# EAGLE design controller (EAGLE 6.3)
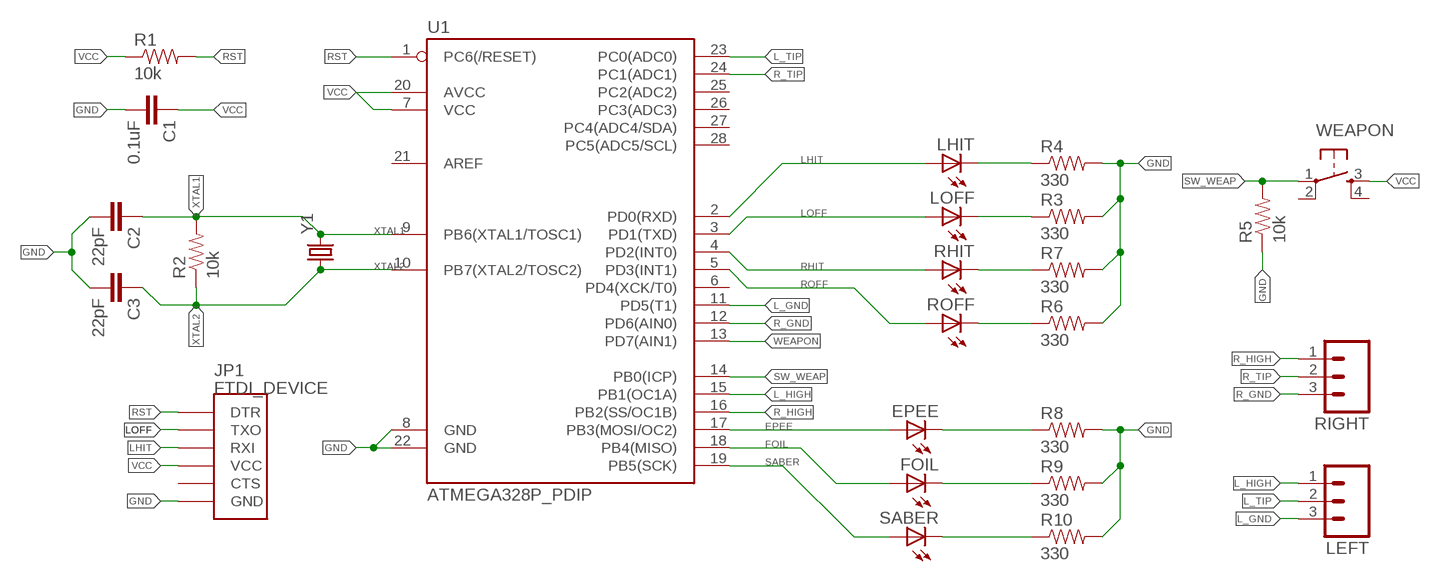
[diagram p0: schematic, sheet 1]

## Parts
C1  0.1uF  CAPKIT  [CAP-PTH-SMALL-KIT]
C2  22pF  CAPKIT  [CAP-PTH-SMALL-KIT]
C3  22pF  CAPKIT  [CAP-PTH-SMALL-KIT]
EPEE  LED5MM  [LED5MM]
FOIL  LED5MM  [LED5MM]
JP1  FTDI_DEVICE  [FTDI_DEVICE_SIDE]
LEFT  M03LOCK_LONGPADS  [1X03_LOCK_LONGPADS]
LHIT  LED5MM  [LED5MM]
LOFF  LED5MM  [LED5MM]
R1  10k  RESISTORPTH-1/4W  [AXIAL-0.4]
R2  10k  RESISTORPTH-1/4W  [AXIAL-0.4]
R3  330  RESISTOR0603-RES  [0603-RES]
R4  330  RESISTOR0603-RES  [0603-RES]
R5  10k  RESISTORPTH-1/4W  [AXIAL-0.4]
R6  330  RESISTOR0603-RES  [0603-RES]
R7  330  RESISTOR0603-RES  [0603-RES]
R8  330  RESISTOR0603-RES  [0603-RES]
R9  330  RESISTOR0603-RES  [0603-RES]
R10  330  RESISTOR0603-RES  [0603-RES]
RHIT  LED5MM  [LED5MM]
RIGHT  M03LOCK_LONGPADS  [1X03_LOCK_LONGPADS]
ROFF  LED5MM  [LED5MM]
SABER  LED5MM  [LED5MM]
U1  ATMEGA328P_PDIP  [DIL28-3]
WEAPON  TAC_SWITCHPTH  [TACTILE-PTH]
Y1  CRYSTALHC49US  [HC49US]

## Nets
EPEE: EPEE.A U1.17(PB3(MOSI/OC2))
FOIL: FOIL.A U1.18(PB4(MISO))
GND: C1.2 C2.2 C3.2 JP1.P$6(GND) R3.2 R4.2 R5.P$1 R6.2 R7.2 R8.2 R9.2 R10.2 U1.8(GND) U1.22(GND)
L_GND: LEFT.3 U1.11(PD5(T1))
L_HIGH: LEFT.1 U1.15(PB1(OC1A))
L_TIP: LEFT.2 U1.23(PC0(ADC0))
LHIT: JP1.P$3(RXI) LHIT.A U1.2(PD0(RXD))
LOFF: JP1.P$2(TXO) LOFF.A U1.3(PD1(TXD))
N$1: LHIT.K(C) R4.1
N$2: LOFF.K(C) R3.1
N$3: R7.1 RHIT.K(C)
N$4: R6.1 ROFF.K(C)
N$5: FOIL.K(C) R9.1
N$6: R10.1 SABER.K(C)
N$8: EPEE.K(C) R8.1
R_GND: RIGHT.3 U1.12(PD6(AIN0))
R_HIGH: RIGHT.1 U1.16(PB2(SS/OC1B))
R_TIP: RIGHT.2 U1.24(PC1(ADC1))
RHIT: RHIT.A U1.4(PD2(INT0))
ROFF: ROFF.A U1.5(PD3(INT1))
RST: JP1.P$1(DTR) R1.P$2 U1.1(PC6(/RESET))
SABER: SABER.A U1.19(PB5(SCK))
SW_WEAP: R5.P$2 U1.14(PB0(ICP)) WEAPON.1
VCC: C1.1 JP1.P$4(VCC) R1.P$1 U1.7(VCC) U1.20(AVCC) WEAPON.3
WEAPON: U1.13(PD7(AIN1))
XTAL1: C2.1 R2.P$2 U1.9(PB6(XTAL1/TOSC1)) Y1.2
XTAL2: C3.1 R2.P$1 U1.10(PB7(XTAL2/TOSC2)) Y1.1
Unconnected: JP1.P$5(CTS) U1.6(PD4(XCK/T0)) U1.21(AREF) U1.25(PC2(ADC2)) U1.26(PC3(ADC3)) U1.27(PC4(ADC4/SDA)) U1.28(PC5(ADC5/SCL)) WEAPON.2 WEAPON.4

## Library data of the parts
C1-C3 = SparkFun-Capacitors:CAP: Capacitor Standard 0603 ceramic capacitor, and 0.1" leaded capacitor.
EPEE FOIL LHIT LOFF RHIT ROFF SABER = SparkFun-LED:LED: LEDs Standard schematic elements and footprints for 5mm, 3mm, 1206, and 0603 sized LEDs. 5mm - Spark Fun Electronics SKU : COM-00529 (and others)
JP1 = SparkFun-Connectors:FTDI_DEVICE: Connector which mates to FTDI basic or FTDI cable.
LEFT RIGHT = SparkFun-Connectors:M03: Header 3 Standard 3-pin 0.1" header. Use with straight break away headers (SKU : PRT-00116), right angle break away headers (PRT-00553), swiss pins (PRT-00743), machine pins (PRT-00117), and female headers (PRT-00115). Molex polarized connector foot print use with SKU : PRT-08232 with associated crimp pins and housings.
R1-R10 = SparkFun-Resistors:RESISTOR: Resistor Basic schematic elements and footprints for 0603, 1206, and PTH resistors.
U1 = SparkFun-DigitalIC:ATMEGA328P_PDIP: uC used in the Arduino 32kb flash, 1k EEPROM, 2k SRAM This is the through-hole version of this chip.
WEAPON = SparkFun-Electromechanical:TAC_SWITCH: Momentary Switch Button commonly used for reset or general input. Spark Fun Electronics SKU : COM-00097 SMT- SWCH-08247
Y1 = SparkFun-FreqCtrl:CRYSTAL: Various standard crystals. Proven footprints. Spark Fun Electronics SKU : COM-00534

## Board
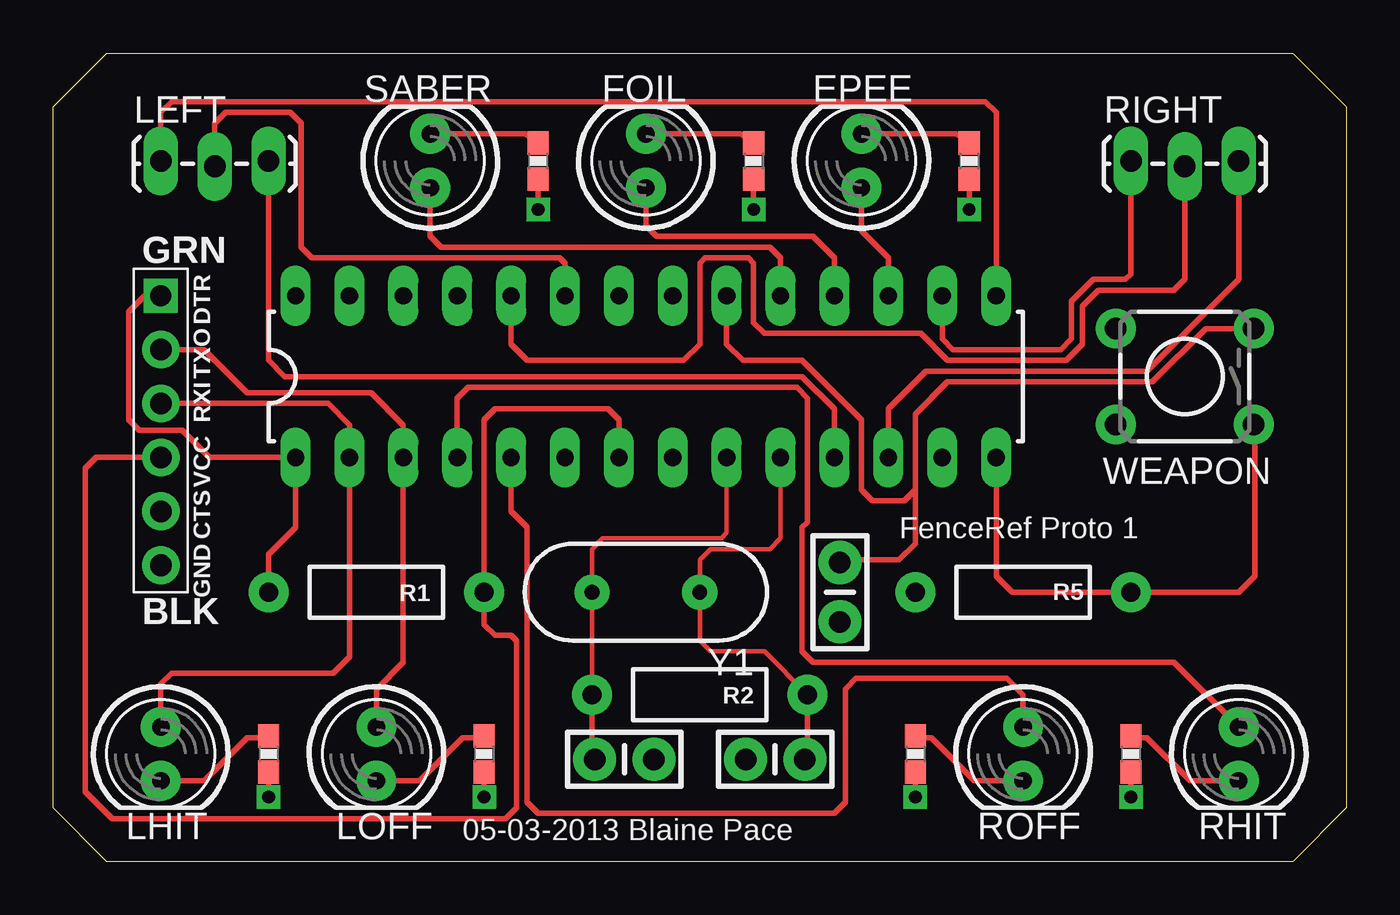
[diagram p1: board, top side]
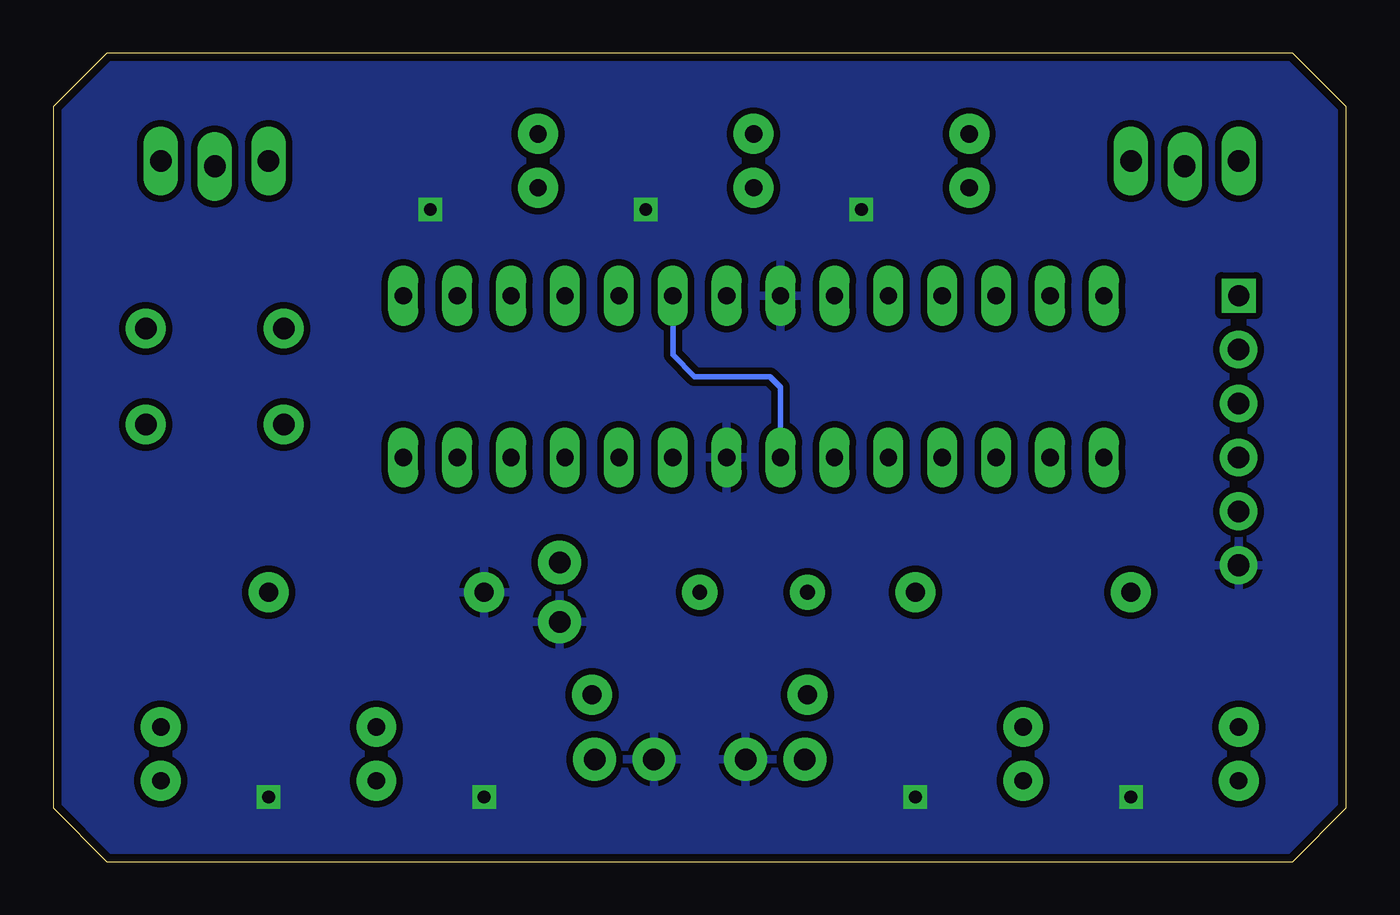
[diagram p2: board, bottom side, seen from below]

Size 60.96 x 38.1 mm. Coordinates in mm from the lower left corner, seen from the top.
Outline: 0,35.56 2.54,38.1 58.42,38.1 60.96,35.56 60.96,2.54 58.42,0 2.54,0 0,2.54 0,35.56
Copper layers (1*16): Top 0.0356mm / dielectric 1.5011mm / Bottom 0.0356mm
Design rules "oshpark *": minimum track width 6mil, minimum drill 13mil, track to track 6mil, track to pad 6mil, pad to pad 6mil, via to via 6mil, smd to smd 6mil, copper to edge 15mil, drill to drill 6mil, minimum pad ring 12mil, minimum via ring 10mil, stop-mask expansion 4mil, vias tented up to drill 0mil, thermal gap 10mil

### Footprints (pad centres in the part's own frame; a part is rotated, then mirrored left to right if it is on the bottom)
CAP-PTH-SMALL-KIT = drill 1.016 pad 2.032: 1 -1.397,0; 2 1.397,0
LED5MM = drill 0.813 pad 1.88: A -1.27,0; K 1.27,0
FTDI_DEVICE_SIDE = drill 1 square: P$1 -6.35,0 | drill 1.016 pad 1.778: P$2 -3.81,0; P$3 -1.27,0; P$4 1.27,0; P$5 3.81,0; P$6 6.35,0
1X03_LOCK_LONGPADS = drill 1.016 long: 1 0,0; 2 2.54,-0.254; 3 5.08,0
AXIAL-0.4 = drill 0.9 pad 1.88: P$1 -5.08,0; P$2 5.08,0
0603-RES = smd 1.1 x 1: 1 -0.85,0; 2 0.85,0
DIL28-3 = drill 0.813 long: 1 -16.51,-3.81; 2 -13.97,-3.81; 3 -11.43,-3.81; 4 -8.89,-3.81; 5 -6.35,-3.81; 6 -3.81,-3.81; 7 -1.27,-3.81; 8 1.27,-3.81; 9 3.81,-3.81; 10 6.35,-3.81; 11 8.89,-3.81; 12 11.43,-3.81; 13 13.97,-3.81; 14 16.51,-3.81; 15 16.51,3.81; 16 13.97,3.81; 17 11.43,3.81; 18 8.89,3.81; 19 6.35,3.81; 20 3.81,3.81; 21 1.27,3.81; 22 -1.27,3.81; 23 -3.81,3.81; 24 -6.35,3.81; 25 -8.89,3.81; 26 -11.43,3.81; 27 -13.97,3.81; 28 -16.51,3.81
TACTILE-PTH = drill 1.016 pad 1.88: 1 -3.251,2.261; 2 3.251,2.261; 3 -3.251,-2.261; 4 3.251,-2.261
HC49US = drill 0.7 pad 1.651: 1 -2.54,0; 2 2.54,0

### Placement (x,y rotation side)
C1  37.08,12.7 270 top
C2  26.92,4.83 0 top
C3  34.04,4.83 180 top
EPEE  38.1,33.02 90 top
FOIL  27.94,33.02 90 top
JP1  5.08,20.32 270 top
LEFT  5.08,33.02 0 top
LHIT  5.08,5.08 270 top
LOFF  15.24,5.08 270 top
R1  15.24,12.7 180 top
R2  30.48,7.87 180 top
R3  20.32,5.08 270 top
R4  10.16,5.08 270 top
R5  45.72,12.7 0 top
R6  40.64,5.08 270 top
R7  50.8,5.08 270 top
R8  43.18,33.02 270 top
R9  33.02,33.02 270 top
R10  22.86,33.02 270 top
RHIT  55.88,5.08 270 top
RIGHT  50.8,33.02 0 top
ROFF  45.72,5.08 270 top
SABER  17.78,33.02 90 top
U1  27.94,22.86 0 top
WEAPON  53.34,22.86 180 top
Y1  27.94,12.7 180 top

### Tracks (layer width: path | path; a pad name or v marks a point on that pad's centre or on a via)
EPEE
  Top 0.254: U1.17 39.37,28.45 38.1,29.72 EPEE.A
FOIL
  Top 0.254: U1.18 36.83,28.45 35.81,29.46 28.45,29.46 27.94,29.97 FOIL.A
GND  (via drill 0.6)
  Top 0.254: R10.2 v22.86,30.73 | R9.2 v33.02,30.73 | R8.2 v43.18,30.73 | R4.2 v10.16,3.05 | R3.2 v20.32,3.05 | R6.2 v40.64,3.05 | R7.2 v50.8,3.05
  pour Bottom (isolate 0.305): 0,38.1 0,0 60.96,0 60.96,38.1
L_GND
  Top 0.254: LEFT.3 10.16,23.62 10.92,22.86 35.31,22.86 36.83,21.34 U1.11
L_HIGH
  Top 0.254: LEFT.1 5.08,35.31 5.59,35.81 43.94,35.81 44.45,35.31 U1.15
L_TIP
  Top 0.254: U1.23 24.13,28.19 23.88,28.45 12.19,28.45 11.68,28.96 11.68,34.8 11.18,35.31 8.13,35.31 7.62,34.8 LEFT.2
LHIT
  Top 0.254: LHIT.A 5.08,8.38 5.59,8.89 13.21,8.89 13.97,9.65 U1.2 13.97,20.57 12.95,21.59 JP1.P$3
LOFF
  Top 0.254: LOFF.A 15.24,8.13 16.51,9.4 U1.3 16.51,20.57 14.99,22.1 9.14,22.1 7.11,24.13 JP1.P$2
N$1
  Top 0.254: R4.1 10.05,5.84 9.14,5.84 7.11,3.81 LHIT.K
N$2
  Top 0.254: R3.1 20.21,5.84 19.3,5.84 17.27,3.81 LOFF.K
N$3
  Top 0.254: R7.1 50.91,5.84 51.56,5.84 53.59,3.81 RHIT.K
N$4
  Top 0.254: R6.1 40.75,5.84 41.4,5.84 43.43,3.81 ROFF.K
N$5
  Top 0.254: R9.1 32.4,34.29 FOIL.K
N$6
  Top 0.254: R10.1 22.24,34.29 SABER.K
N$8
  Top 0.254: R8.1 42.56,34.29 EPEE.K
R_GND
  Top 0.254: U1.12 39.37,21.34 41.15,23.11 51.56,23.11 55.88,27.43 RIGHT.3
R_HIGH
  Top 0.254: RIGHT.1 50.8,27.69 50.55,27.43 49.02,27.43 48.01,26.42 48.01,24.64 47.5,24.13 42.42,24.13 41.91,24.64 U1.16
R_TIP
  Top 0.254: RIGHT.2 53.34,27.43 52.83,26.92 49.28,26.92 48.51,26.16 48.51,24.38 47.75,23.62 42.16,23.62 40.89,24.89 33.53,24.89 33.02,25.4 33.02,28.19 32.77,28.45 30.73,28.45 30.48,28.19 30.48,24.38 29.72,23.62 22.35,23.62 21.59,24.38 U1.24
RHIT
  Top 0.254: RHIT.A 52.83,9.4 35.81,9.4 35.31,9.91 35.31,15.75 35.56,16 35.56,21.84 35.05,22.35 19.56,22.35 19.05,21.84 U1.4
ROFF
  Top 0.254: ROFF.A 45.72,7.87 44.96,8.64 37.85,8.64 37.34,8.13 37.34,2.79 36.83,2.29 22.86,2.29 22.35,2.79 22.35,15.75 21.59,16.51 U1.5
RST
  Top 0.254: JP1.P$1 4.32,26.67 3.56,25.91 3.56,20.83 4.06,20.32 6.1,20.32 7.37,19.05 U1.1 11.43,15.75 10.16,14.48 R1.P$2
SABER
  Top 0.254: U1.19 34.29,28.45 33.78,28.96 18.29,28.96 17.78,29.46 SABER.A
SW_WEAP
  Top 0.254: U1.14 44.45,13.46 45.21,12.7 R5.P$2 55.88,12.7 56.64,13.46 56.64,20.55 WEAPON.1
VCC
  Top 0.254: WEAPON.3 54.33,25.12 51.82,22.61 42.16,22.61 40.64,21.08 40.64,17.53 | 40.64,17.53 40.64,14.99 39.88,14.22 37.21,14.22 C1.1 | JP1.P$4 2.03,19.05 1.52,18.54 1.52,3.3 2.79,2.03 21.34,2.03 21.84,2.54 21.84,10.41 21.59,10.67 20.83,10.67 20.32,11.18 R1.P$1 20.32,20.83 20.83,21.34 26.16,21.34 26.67,20.83 U1.7 | 40.64,17.53 40.13,17.02 38.61,17.02 38.1,17.53 38.1,20.83 35.31,23.62 32.51,23.62 31.75,24.38 U1.20
  Bottom 0.254: U1.20 31.75,23.88 30.73,22.86 27.18,22.86 26.67,22.35 U1.7
XTAL1
  Top 0.203: R2.P$2 Y1.2 25.4,14.73 25.91,15.24 31.5,15.24 31.75,15.49 U1.9
  Top 0.254: R2.P$2 25.4,4.95 C2.1
XTAL2
  Top 0.203: R2.P$1 33.53,9.91 30.99,9.91 30.48,10.41 Y1.1 30.48,14.22 30.99,14.73 33.78,14.73 34.29,15.24 U1.10
  Top 0.254: R2.P$1 35.56,4.95 C3.1

### Text on the board
tPlace: FenceRef Proto 1 | 05-03-2013 Blaine Pace
_tsilk: SABER | FOIL | EPEE | LEFT | RIGHT | GRN | DTR | TXO | RXI | VCC | WEAPON | CTS | GND | FenceRef Proto 1 | R1 | R5 | BLK | R2 | LHIT | LOFF | 05-03-2013 Blaine Pace | ROFF | RHIT